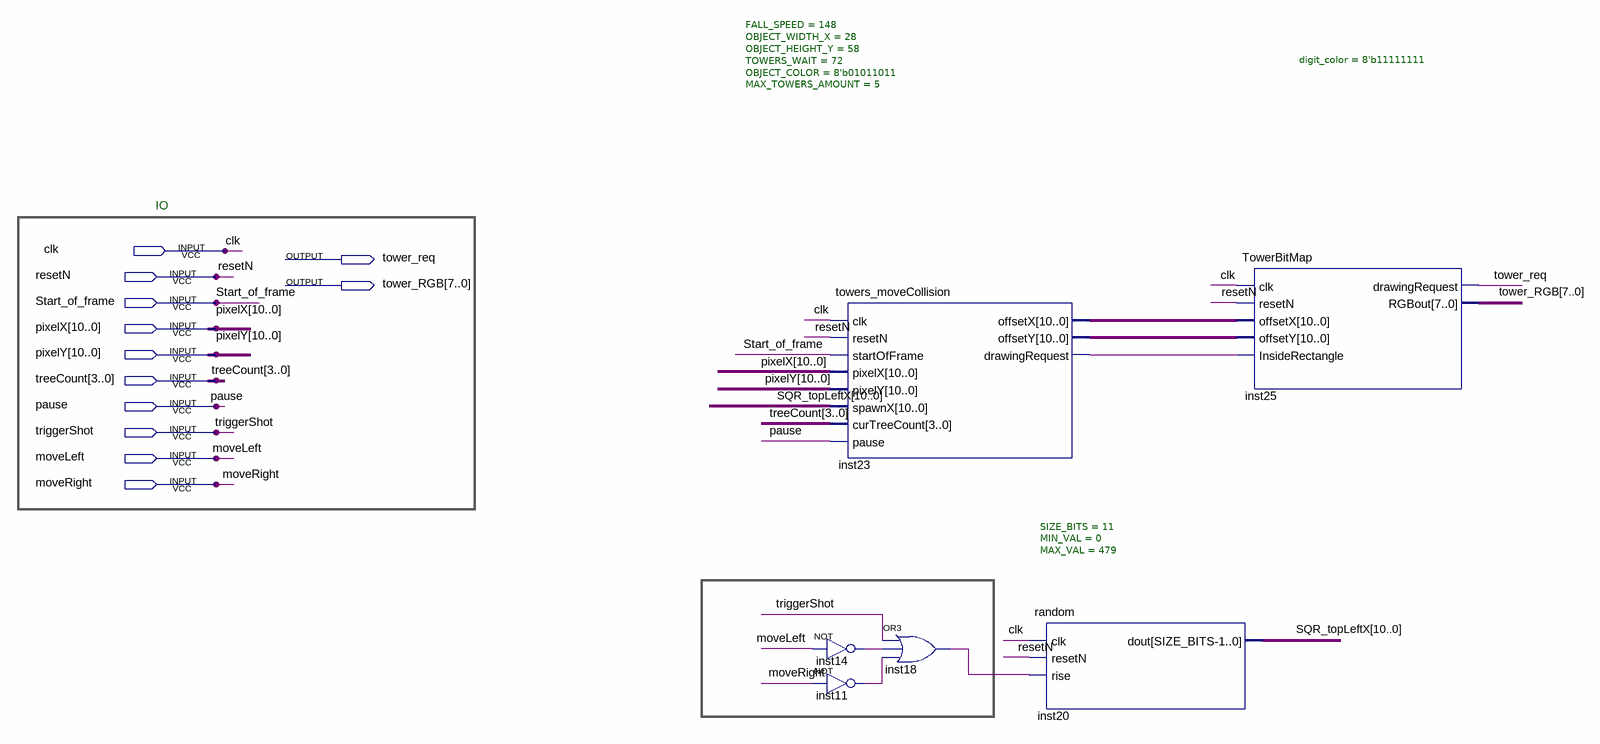
[diagram p0: schematic sheet]
// Quartus schematic TOP_TOWERS.bdf as structural Verilog: 6 symbols, 12 pins
module TOP_TOWERS (
  input  clk,
  input  resetN,
  input  Start_of_frame,
  input  [10:0] pixelX,
  input  [10:0] pixelY,
  input  [3:0] treeCount,
  input  pause,
  input  triggerShot,
  input  moveLeft,
  input  moveRight,
  output tower_req,
  output [7:0] tower_RGB
);

  wire inst11_out, inst14_out, inst18_out, inst23_drawingrequest;
  wire [10:0] inst23_offsetx, inst23_offsety, SQR_topLeftX;

  towers_moveCollision #(.FALL_SPEED(148), .OBJECT_WIDTH_X(28), .OBJECT_HEIGHT_Y(58), .TOWERS_WAIT(72), .OBJECT_COLOR(8'b01011011), .MAX_TOWERS_AMOUNT(5)) inst23 (
    .clk(clk), .resetN(resetN), .startOfFrame(Start_of_frame), .pixelX(pixelX), .pixelY(pixelY),
    .spawnX(SQR_topLeftX), .curTreeCount(treeCount), .pause(pause), .offsetX(inst23_offsetx),
    .offsetY(inst23_offsety), .drawingRequest(inst23_drawingrequest));
  not inst14 (inst14_out, moveLeft);
  not inst11 (inst11_out, moveRight);
  or inst18 (inst18_out, triggerShot, inst14_out, inst11_out);
  random #(.SIZE_BITS(11), .MIN_VAL(0), .MAX_VAL(479)) inst20 (
    .clk(clk), .resetN(resetN), .rise(inst18_out), .dout(SQR_topLeftX));
  TowerBitMap #(.digit_color(8'b11111111)) inst25 (
    .clk(clk), .resetN(resetN), .offsetX(inst23_offsetx), .offsetY(inst23_offsety),
    .InsideRectangle(inst23_drawingrequest), .drawingRequest(tower_req), .RGBout(tower_RGB));

  // Notes on the sheet:
  //   IO
endmodule
